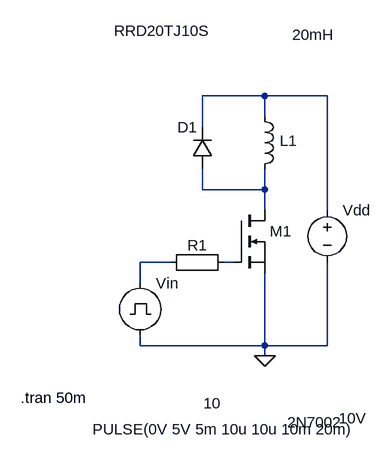
[diagram p0: schematic FET-switch-fig.asc]
FET-switch-fig.asc, the LTspice schematic file:
Version 4
SHEET 1 880 680
WIRE 256 48 160 48
WIRE 352 48 256 48
WIRE 256 80 256 48
WIRE 160 96 160 48
WIRE 160 192 160 160
WIRE 256 192 256 160
WIRE 256 192 160 192
WIRE 256 224 256 192
WIRE 352 224 352 48
WIRE 112 304 64 304
WIRE 208 304 192 304
WIRE 64 336 64 304
WIRE 64 432 64 416
WIRE 256 432 256 320
WIRE 256 432 64 432
WIRE 352 432 352 304
WIRE 352 432 256 432
WIRE 256 448 256 432
FLAG 256 448 0
SYMBOL voltage 352 208 R0
WINDOW 123 0 0 Left 0
WINDOW 39 0 0 Left 0
WINDOW 3 18 336 Left 2
SYMATTR InstName Vdd
SYMATTR Value 10V
SYMBOL nmos 208 224 R0
WINDOW 3 83 326 Left 2
SYMATTR InstName M1
SYMATTR Value 2N7002
SYMBOL ind 240 64 R0
WINDOW 0 39 53 Left 2
WINDOW 3 58 -110 Left 2
SYMATTR InstName L1
SYMATTR Value 20mH
SYMATTR SpiceLine Rser=68
SYMBOL diode 176 160 R180
WINDOW 0 24 64 Left 2
WINDOW 3 4 212 Left 2
SYMATTR InstName D1
SYMATTR Value RRD20TJ10S
SYMBOL Misc\\EuropeanResistor 208 288 R90
WINDOW 0 5 56 VBottom 2
WINDOW 3 217 33 VTop 2
SYMATTR InstName R1
SYMATTR Value 10
SYMBOL pulse 64 320 R0
WINDOW 3 -73 241 Left 2
SYMATTR InstName Vin
SYMATTR Value PULSE(0V 5V 5m 10u 10u 10m 20m)
TEXT -120 512 Left 2 !.tran 50m

The netlist it stands for:
* FET-switch-fig.asc
Vdd N001 0 10V
M1 N002 N004 0 0 2N7002
L1 N001 N002 20mH Rser=68
D1 N002 N001 RRD20TJ10S
R1 N004 N003 10
Vin N003 0 PULSE(0V 5V 5m 10u 10u 10m 20m)
.model D D
.lib standard.dio
.model NMOS NMOS
.model PMOS PMOS
.lib standard.mos
.tran 50m
.backanno
.end